# EAGLE design supply_L5973 (EAGLE 6.1)
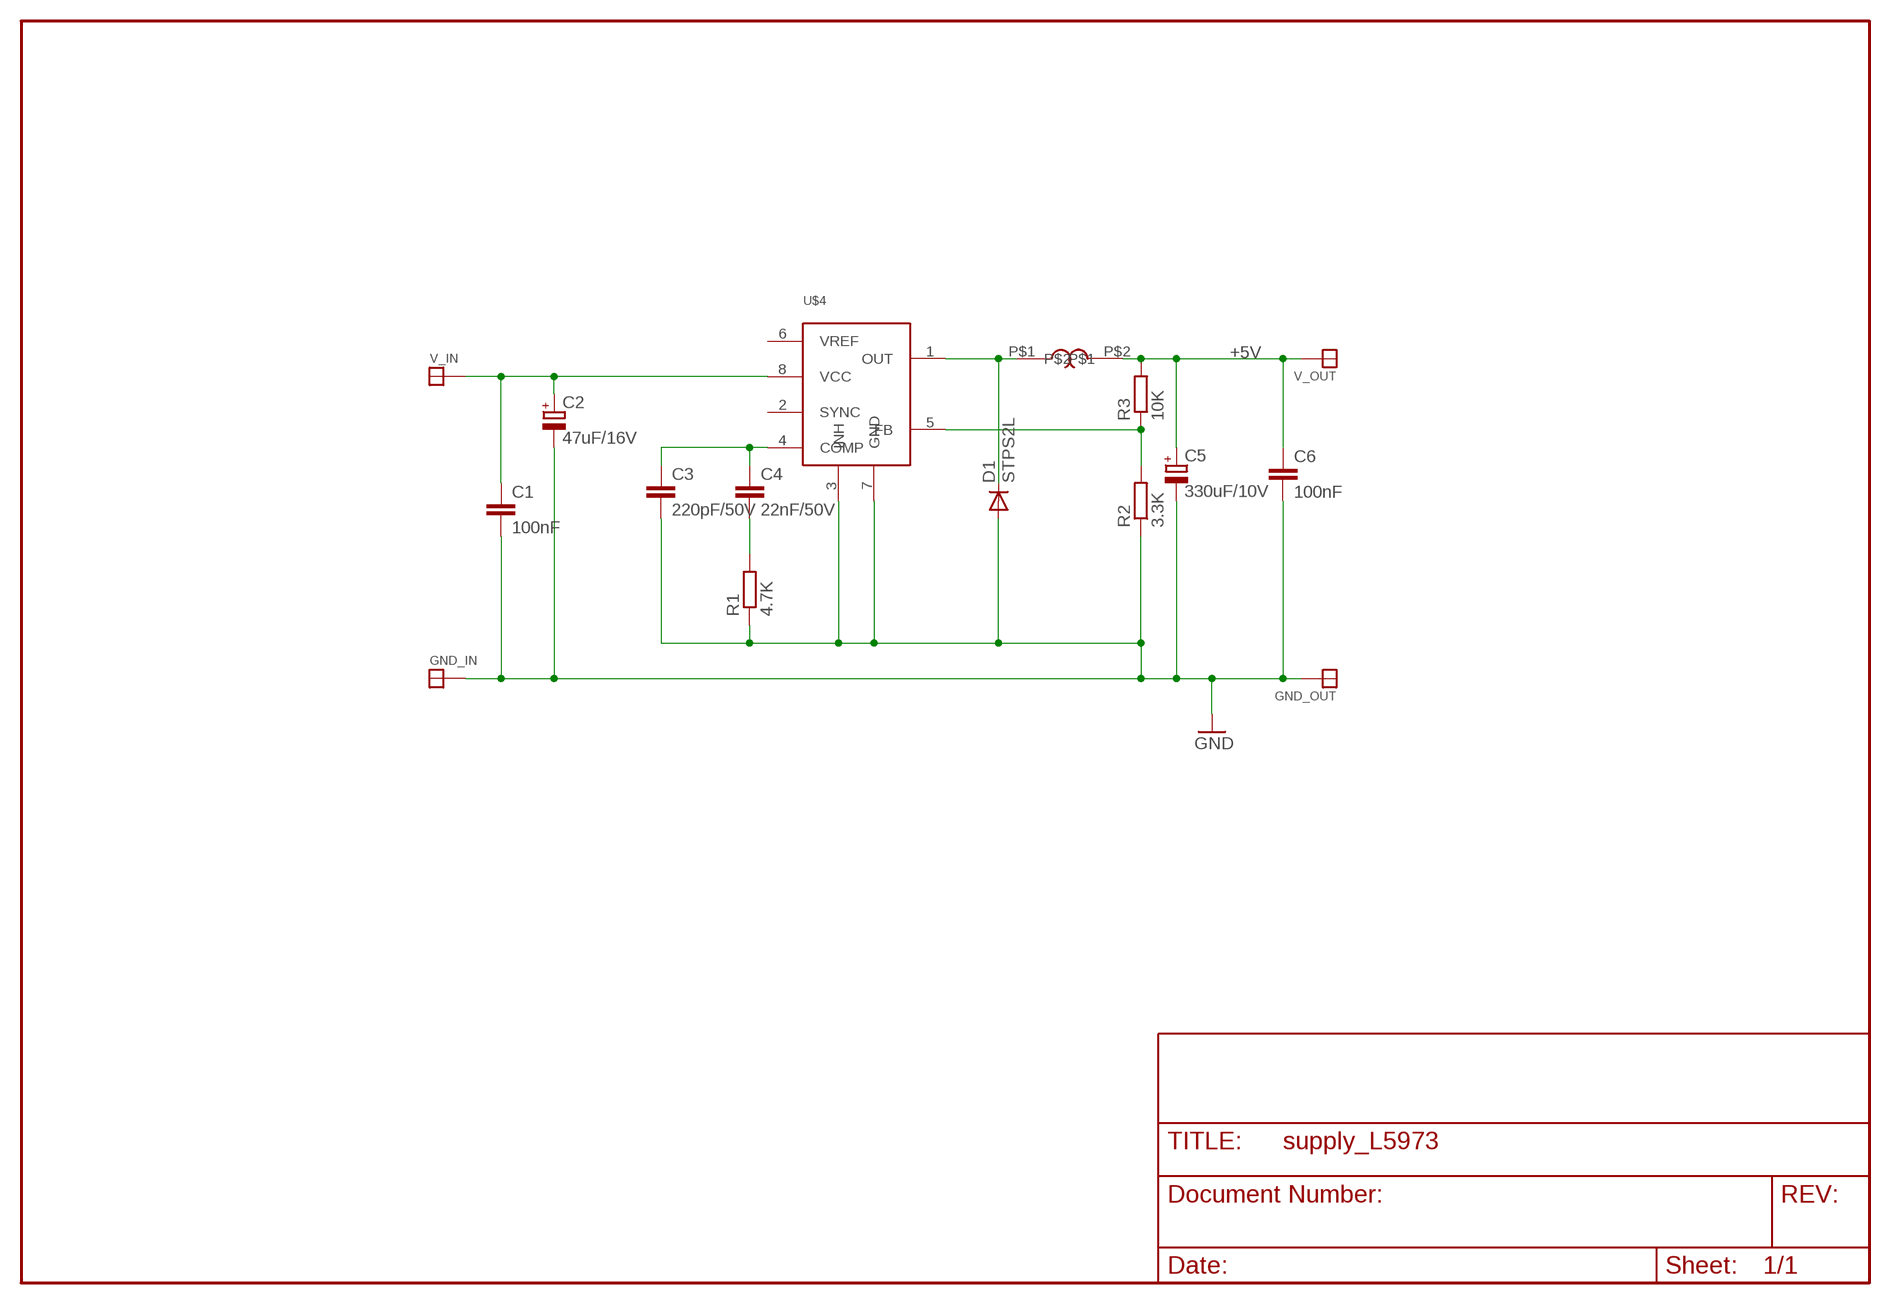
[diagram p0: schematic, sheet 1]

## Parts
C1  100nF  C-EUC0603  [C0603]
C2  47uF/16V  CPOL-EUD/7343-31R  [D/7343-31R]
C3  220pF/50V  C-EUC1206K  [C1206K]
C4  22nF/50V  C-EUC1206K  [C1206K]
C5  330uF/10V  CPOL-EUD/7343-31R  [D/7343-31R]
C6  100nF  C-EUC0603  [C0603]
D1  STPS2L  [SMA]
GND_IN  SOLDER_PAD100_50  [SOLDER_PAD_100_50]
GND_OUT  SOLDER_PAD100_50  [SOLDER_PAD_100_50]
L1  15uH  WE_PD  [WE_PD]
R1  4.7K  R-EU_R0603  [R0603]
R2  3.3K  R-EU_R0603  [R0603]
R3  10K  R-EU_R0603  [R0603]
U$4  L5973D  [SO08]
V_IN  SOLDER_PAD100_50  [SOLDER_PAD_100_50]
V_OUT  SOLDER_PAD100_50  [SOLDER_PAD_100_50]

## Nets
+5V: C5.+ C6.1 L1.P$2 R3.2 V_OUT.P$1
GND: C1.2 C2.- C3.2 C5.- C6.2 D1.P$1(A) GND_IN.P$1 GND_OUT.P$1 R1.1 R2.1 U$4.3(INH) U$4.7(GND)
N$6: C3.1 C4.1 U$4.4(COMP)
N$8: C4.2 R1.2
N$9: D1.P$2(C) L1.P$1 U$4.1(OUT)
N$10: R2.2 R3.1 U$4.5(FB)
VBAT: C1.1 C2.+ U$4.8(VCC) V_IN.P$1
Unconnected: U$4.2(SYNC) U$4.6(VREF)

## Library data of the parts
C1 C3 C4 C6 = rcl:C-EU: CAPACITOR, European symbol
C2 C5 = rcl:CPOL-EU: POLARIZED CAPACITOR, European symbol
D1 = paparazzi:STPS2L
GND_IN GND_OUT V_IN V_OUT = paparazzi:SOLDER_PAD
L1 = paparazzi:WE_PD
R1-R3 = rcl:R-EU_: RESISTOR, European symbol
U$4 = paparazzi:L5973D

## Board
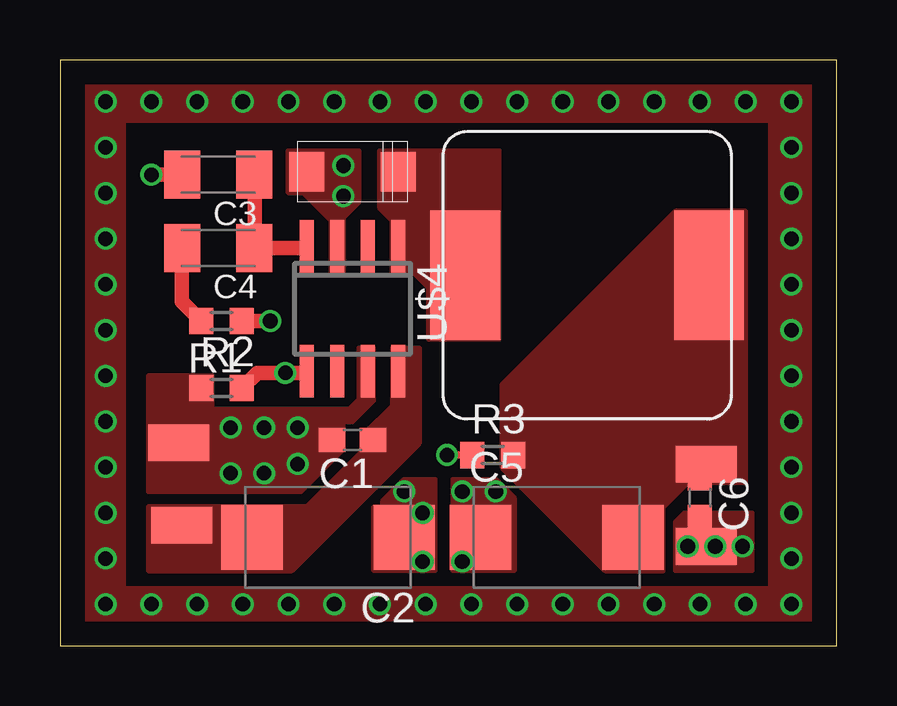
[diagram p1: board, top side]
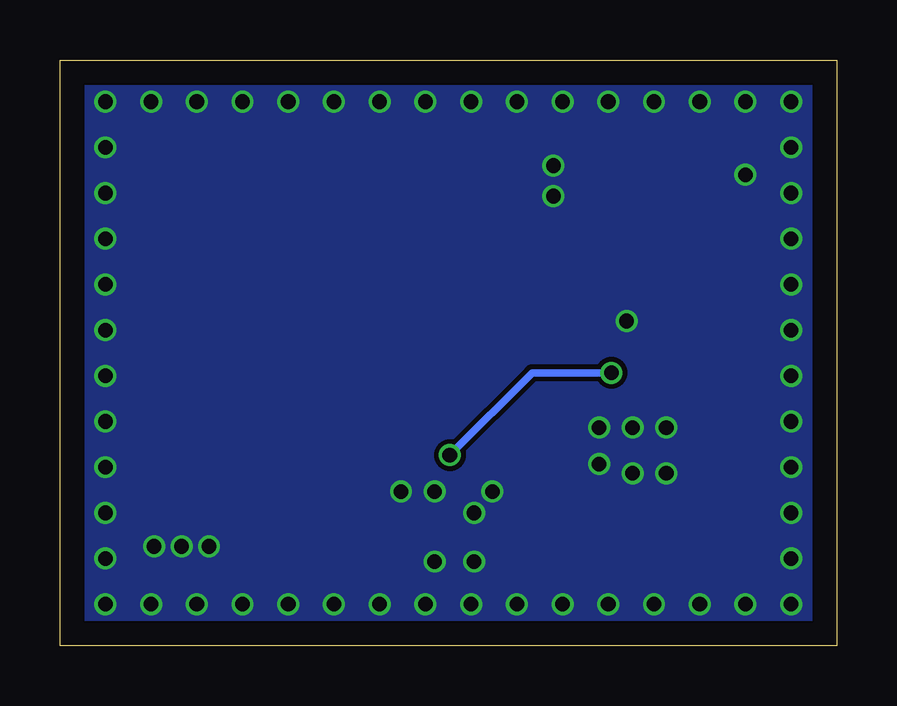
[diagram p2: board, bottom side, seen from below]

Size 32.37 x 24.43 mm. Coordinates in mm from the lower left corner, seen from the top.
Outline: 0,0 32.37,0 32.37,24.43 0,24.43 0,0
Copper layers (1*16): Top 0.035mm / dielectric 1.5mm / Bottom 0.035mm
Design rules: minimum track width 0.2mm, minimum drill 0.35mm, track to track 0.2mm, track to pad 0.2mm, pad to pad 0.2mm, via to via 0.2mm, smd to smd 0.2mm, copper to edge 40mil, drill to drill 8mil, minimum pad ring 10mil, minimum via ring 5mil, stop-mask expansion 4mil, vias tented up to drill 0mil, thermal gap 10mil

### Footprints (pad centres in the part's own frame; a part is rotated, then mirrored left to right if it is on the bottom)
C0603 = smd 1.1 x 1: 1 -0.85,0; 2 0.85,0
D/7343-31R = smd 2.55 x 2.7: + 3.175,0; - -3.175,0
C1206K = smd 1.5 x 2: 1 -1.5,0; 2 1.5,0
SMA = smd 1.45 x 1.65: P$1 -1.905,0; P$2 1.905,0
SOLDER_PAD_100_50 = smd 2.54 x 1.524: P$1 0,0
WE_PD = smd 2.9 x 5.4: P$1 -5.08,0; P$2 5.08,0
R0603 = smd 1 x 1.1: 1 -0.85,0; 2 0.85,0
SO08 = smd 0.6 x 2.2: 1 -1.905,-2.6; 2 -0.635,-2.6; 3 0.635,-2.6; 4 1.905,-2.6; 5 1.905,2.6; 6 0.635,2.6; 7 -0.635,2.6; 8 -1.905,2.6

### Placement (x,y rotation side)
C1  12.19,8.6 180 top
C2  11.17,4.53 180 top
C3  6.6,19.65 180 top
C4  6.6,16.6 180 top
C5  20.7,4.53 0 top
C6  26.66,6.18 270 top
D1  12.19,19.77 0 top
GND_IN  4.95,8.47 0 top
GND_OUT  26.92,4.15 0 top
L1  21.97,15.46 0 top
R1  6.73,13.55 180 top
R2  6.73,10.76 0 top
R3  18.03,7.96 0 top
U$4  12.19,14.06 180 top
V_IN  5.08,5.04 0 top
V_OUT  26.92,7.58 0 top

### Tracks (layer width: path | path; a pad name or v marks a point on that pad's centre or on a via)
+5V
  pour Top (no thermals): 28.57,18.12 25.65,18.12 18.41,10.88 18.41,7.46 22.73,3.14 25.14,3.14 25.14,5.8 26.16,6.82 28.57,6.82
GND  (via drill 0.61)
  Top 0.61: C3.2 v3.8,19.65 | R1.1 v8.76,13.55
  other vias: 1.9,22.7 3.8,22.7 5.71,22.7 7.62,22.7 9.52,22.7 11.43,22.7 13.33,22.7 15.24,22.7 17.14,22.7 19.04,22.7 20.95,22.7 22.86,22.7 24.76,22.7 26.66,22.7 28.57,22.7 30.47,22.7 30.47,20.79 30.47,18.88 30.47,16.98 30.47,15.08 30.47,13.17 30.47,11.27 30.47,9.36 30.47,7.46 30.47,5.55 30.47,3.64 30.47,1.74 28.57,1.74 1.9,20.79 1.9,18.88 1.9,16.98 1.9,15.08 1.9,13.17 1.9,11.27 1.9,9.36 1.9,7.46 1.9,5.55 1.9,3.64 1.9,1.74 3.8,1.74 5.71,1.74 7.62,1.74 9.52,1.74 11.43,1.74 13.33,1.74 15.24,1.74 17.14,1.74 19.04,1.74 20.95,1.74 22.86,1.74 24.76,1.74 26.66,1.74 9.9,9.11 7.11,9.11 7.11,7.2 9.9,7.58 8.5,9.11 8.5,7.2 11.81,20.03 11.81,18.76 26.16,4.15 27.3,4.15 28.44,4.15 14.35,6.44 18.16,6.44 16.76,6.44 15.11,3.52 15.11,5.55 16.76,3.52
  pour Top: -0.01,24.22 -0.01,-0.17 31.62,-0.17 31.62,2.38 2.66,2.38 2.66,24.22
  pour Top: 2.66,24.22 2.66,21.93 29.59,21.93 29.59,2.38 31.62,2.38 31.62,24.22
  pour Bottom: -0.01,24.22 31.62,24.22 31.62,-0.17 -0.01,-0.17
  pour Top (no thermals): 3.68,9.11 3.68,6.44 10.03,6.44 11.81,8.22 11.81,9.36 12.19,9.36 13.08,10.25 13.08,12.41 12.44,12.41 12.44,10.25 12.06,9.87 6.34,9.87 6.34,11.27 3.68,11.27
  pour Top (no thermals): 9.52,20.66 12.44,20.66 12.44,18.5 11.81,17.87 11.81,15.58 11.3,15.58 11.3,17.74 10.16,18.88 9.52,18.88
  pour Top (no thermals): 13.46,6.06 14.35,6.95 15.62,6.95 15.62,3.14 13.08,3.14 13.08,5.8 13.46,5.8
  pour Top (no thermals): 18.79,3.14 16.38,3.14 16.38,6.95 18.16,6.95 18.92,6.18 18.92,3.14
  pour Top (no thermals): 25.65,3.14 25.65,5.17 26.03,5.55 28.82,5.55 28.82,3.26 28.82,3.14
N$6
  Top 0.61: C3.1 8.12,19.65 8.12,16.6 C4.1 10.28,16.6 U$4.4
N$8
  Top 0.61: C4.2 5.08,16.57 5.08,14.35 R1.2
N$9
  pour Top (no thermals): 13.84,17.74 13.33,18.25 13.33,20.66 18.28,20.66 18.28,12.79 15.36,12.79 15.36,14.95 14.73,15.58 13.84,15.58
N$10  (via drill 0.61)
  Top 0.305: v16.12,7.96 R3.1
  Top 0.61: U$4.5 10.28,11.39 v9.39,11.39 8.21,11.39 R2.2
  Bottom 0.305: v16.12,7.96 12.7,11.39 v9.39,11.39
VBAT
  pour Top (no thermals): 3.68,5.8 3.68,3.14 9.65,3.14 14.98,8.47 14.98,12.41 13.84,12.41 13.84,10 12.7,8.85 12.7,8.22 10.28,5.8

### Text on the board
tDocu: Paparazzi supply V0.9 | by Poine | V out | GND in | GND out | VBAT in